# EAGLE schematic uRinks_v2.0 (EAGLE 9.2.1)

## Sheet 1 of 5
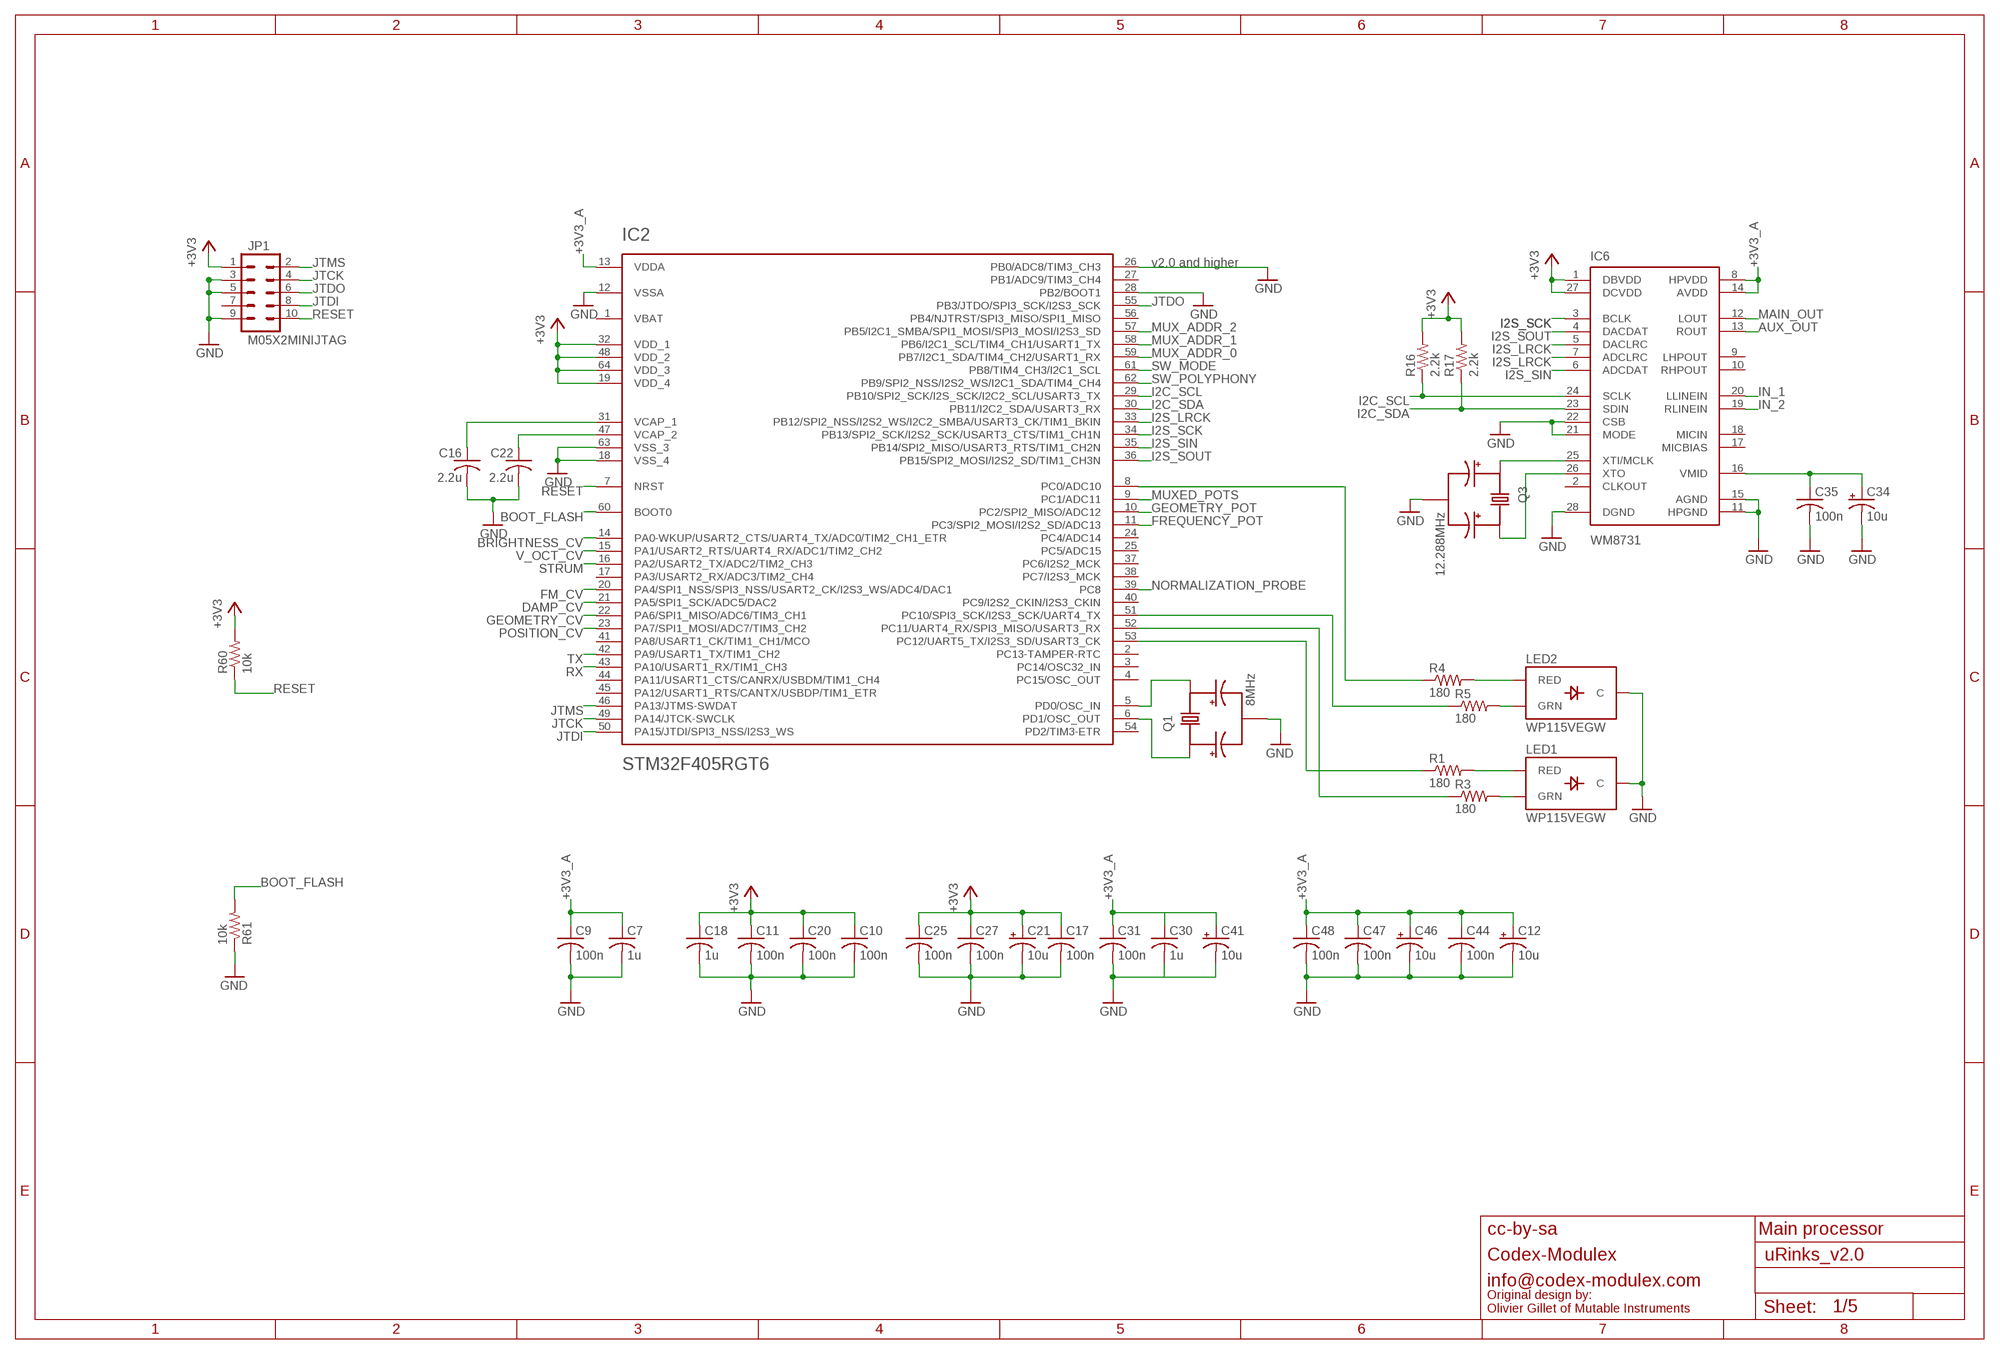
[diagram p0: schematic, sheet 1]

### Parts
C7  1u  C-USC0603  [C0603]
C9  100n  C-USC0603  [C0603]
C10  100n  C-USC0603  [C0603]
C11  100n  C-USC0603  [C0603]
C12  10u  CPOL-USA  [PANASONIC_A]
C16  2.2u  C-USC0805  [C0805]
C17  100n  C-USC0603  [C0603]
C18  1u  C-USC0603  [C0603]
C20  100n  C-USC0603  [C0603]
C21  10u  CPOL-USA  [PANASONIC_A]
C22  2.2u  C-USC0805  [C0805]
C25  100n  C-USC0603  [C0603]
C27  100n  C-USC0603  [C0603]
C30  1u  C-USC0603  [C0603]
C31  100n  C-USC0603  [C0603]
C34  10u  CPOL-USA  [PANASONIC_A]
C35  100n  C-USC0603  [C0603]
C41  10u  CPOL-USA  [PANASONIC_A]
C44  100n  C-USC0603  [C0603]
C46  10u  CPOL-USA  [PANASONIC_A]
C47  100n  C-USC0603  [C0603]
C48  100n  C-USC0603  [C0603]
IC2  STM32F405RGT6  STM32F20X  [TQFP-10X10-64]
IC6  WM8731  [SSOP28]
JP1  M05X2MINIJTAG  [2X5-1.27]
LED1  WP115VEGW  LED-BICOLOR-THROUGHHOLE  [LED-BICOLOR-THROUGHHOLE]
LED2  WP115VEGW  LED-BICOLOR-THROUGHHOLE  [LED-BICOLOR-THROUGHHOLE]
Q1  8MHz  INSTRUO_CRYSTAL_SMALLER  [INSTRUO_CRYSTAL_SMALLER]
Q3  12.288MHz  INSTRUO_CRYSTAL_SMALLER  [INSTRUO_CRYSTAL_SMALLER]
R1  180  R-US_R0603  [R0603]
R3  180  R-US_R0603  [R0603]
R4  180  R-US_R0603  [R0603]
R5  180  R-US_R0603  [R0603]
R16  2.2k  R-US_R0603  [R0603]
R17  2.2k  R-US_R0603  [R0603]
R60  10k  R-US_R0603  [R0603]
R61  10k  R-US_R0603  [R0603]

### Nets
+3V3: C10.1 C11.1 C17.1 C18.1 C20.1 C21.+ C25.1 C27.1 IC2.19(VDD_4) IC2.32(VDD_1) IC2.48(VDD_2) IC2.64(VDD_3) IC6.1(DBVDD) IC6.27(DCVDD) JP1.1 R16.2 R17.2 R60.2 ; also sheet 4,5
+3V3_A: C7.1 C9.1 C12.+ C30.1 C31.1 C41.+ C44.1 C46.+ C47.1 C48.1 IC2.13(VDDA) IC6.8(HPVDD) IC6.14(AVDD) ; also sheet 2,3,5
AUX_OUT: IC6.13(ROUT) ; also sheet 4
BOOT_FLASH: IC2.60(BOOT0) R61.2
BRIGHTNESS_CV: IC2.14(PA0-WKUP/USART2_CTS/UART4_TX/ADC0/TIM2_CH1_ETR) ; also sheet 3
DAMP_CV: IC2.21(PA5/SPI1_SCK/ADC5/DAC2) ; also sheet 3
FM_CV: IC2.20(PA4/SPI1_NSS/SPI3_NSS/USART2_CK/I2S3_WS/ADC4/DAC1) ; also sheet 3
FREQUENCY_POT: IC2.11(PC3/SPI2_MOSI/I2S2_SD/ADC13) ; also sheet 2
GEOMETRY_CV: IC2.22(PA6/SPI1_MISO/ADC6/TIM3_CH1) ; also sheet 3
GEOMETRY_POT: IC2.10(PC2/SPI2_MISO/ADC12) ; also sheet 2
GND: C7.2 C9.2 C10.2 C11.2 C12.- C16.2 C17.2 C18.2 C20.2 C21.- C22.2 C25.2 C27.2 C30.2 C31.2 C34.- C35.2 C41.- C44.2 C46.- C47.2 C48.2 IC2.12(VSSA) IC2.18(VSS_4) IC2.26(PB0/ADC8/TIM3_CH3) IC2.28(PB2/BOOT1) IC2.63(VSS_3) IC6.11(HPGND) IC6.15(AGND) IC6.21(MODE) IC6.22(CSB) IC6.28(DGND) JP1.3 JP1.5 JP1.9 LED1.2(C) LED2.2(C) Q1.GND Q3.GND R61.1 ; also sheet 2,3,4,5
I2C_SCL: IC2.29(PB10/SPI2_SCK/I2S_SCK/I2C2_SCL/USART3_TX) IC6.24(SCLK) R16.1
I2C_SDA: IC2.30(PB11/I2C2_SDA/USART3_RX) IC6.23(SDIN) R17.1
I2S_LRCK: IC2.33(PB12/SPI2_NSS/I2S2_WS/I2C2_SMBA/USART3_CK/TIM1_BKIN) IC6.5(DACLRC) IC6.7(ADCLRC)
I2S_SCK: IC2.34(PB13/SPI2_SCK/I2S2_SCK/USART3_CTS/TIM1_CH1N) IC6.3(BCLK)
I2S_SIN: IC2.35(PB14/SPI2_MISO/USART3_RTS/TIM1_CH2N) IC6.6(ADCDAT)
I2S_SOUT: IC2.36(PB15/SPI2_MOSI/I2S2_SD/TIM1_CH3N) IC6.4(DACDAT)
IN_1: IC6.20(LLINEIN) ; also sheet 4
IN_2: IC6.19(RLINEIN) ; also sheet 4
JTCK: IC2.49(PA14/JTCK-SWCLK) JP1.4
JTDI: IC2.50(PA15/JTDI/SPI3_NSS/I2S3_WS) JP1.8
JTDO: IC2.55(PB3/JTDO/SPI3_SCK/I2S3_SCK) JP1.6
JTMS: IC2.46(PA13/JTMS-SWDAT) JP1.2
MAIN_OUT: IC6.12(LOUT) ; also sheet 4
MUX_ADDR_0: IC2.59(PB7/I2C1_SDA/TIM4_CH2/USART1_RX) ; also sheet 2
MUX_ADDR_1: IC2.58(PB6/I2C1_SCL/TIM4_CH1/USART1_TX) ; also sheet 2
MUX_ADDR_2: IC2.57(PB5/I2C1_SMBA/SPI1_MOSI/SPI3_MOSI/I2S3_SD) ; also sheet 2
MUXED_POTS: IC2.9(PC1/ADC11) ; also sheet 2
N$7: IC2.6(PD1/OSC_OUT) Q1.X1
N$8: IC2.5(PD0/OSC_IN) Q1.X2
N$12: LED1.3(RED) R1.2
N$13: C22.1 IC2.47(VCAP_2)
N$17: C34.+ C35.1 IC6.16(VMID)
N$19: C16.1 IC2.31(VCAP_1)
N$22: LED1.1(GRN) R3.2
N$27: LED2.3(RED) R4.2
N$35: LED2.1(GRN) R5.2
N$37: IC2.52(PC11/UART4_RX/SPI3_MISO/USART3_RX) R3.1
N$40: IC2.8(PC0/ADC10) R4.1
N$41: IC6.25(XTI/MCLK) Q3.X1
N$42: IC6.26(XTO) Q3.X2
N$43: IC2.53(PC12/UART5_TX/I2S3_SD/USART3_CK) R1.1
N$44: IC2.51(PC10/SPI3_SCK/I2S3_SCK/UART4_TX) R5.1
NORMALIZATION_PROBE: IC2.39(PC8) ; also sheet 4
POSITION_CV: IC2.23(PA7/SPI1_MOSI/ADC7/TIM3_CH2) ; also sheet 3
RESET: IC2.7(NRST) JP1.10 R60.1
RX: IC2.43(PA10/USART1_RX/TIM1_CH3)
STRUM: IC2.16(PA2/USART2_TX/ADC2/TIM2_CH3) ; also sheet 4
SW_MODE: IC2.61(PB8/TIM4_CH3/I2C1_SCL) ; also sheet 2
SW_POLYPHONY: IC2.62(PB9/SPI2_NSS/I2S2_WS/I2C1_SDA/TIM4_CH4) ; also sheet 2
TX: IC2.42(PA9/USART1_TX/TIM1_CH2)
V_OCT_CV: IC2.15(PA1/USART2_RTS/UART4_RX/ADC1/TIM2_CH2) ; also sheet 3
Unconnected: IC2.2(PC13-TAMPER-RTC) IC2.3(PC14/OSC32_IN) IC2.4(PC15/OSC_OUT) IC2.17(PA3/USART2_RX/ADC3/TIM2_CH4) IC2.24(PC4/ADC14) IC2.25(PC5/ADC15) IC2.27(PB1/ADC9/TIM3_CH4) IC2.37(PC6/I2S2_MCK) IC2.38(PC7/I2S3_MCK) IC2.40(PC9/I2S2_CKIN/I2S3_CKIN) IC2.41(PA8/USART1_CK/TIM1_CH1/MCO) IC2.44(PA11/USART1_CTS/CANRX/USBDM/TIM1_CH4) IC2.45(PA12/USART1_RTS/CANTX/USBDP/TIM1_ETR) IC2.54(PD2/TIM3-ETR) IC2.56(PB4/NJTRST/SPI3_MISO/SPI1_MISO) IC6.2(CLKOUT) IC6.9(LHPOUT) IC6.10(RHPOUT) IC6.17(MICBIAS) IC6.18(MICIN) JP1.7

### Notes on the sheet
- v2.0 and higher
- cc-by-sa | Main processor
- Codex-Modulex
- info@codex-modulex.com
- Original design by:
  Olivier Gillet of Mutable Instruments

## Sheet 2 of 5
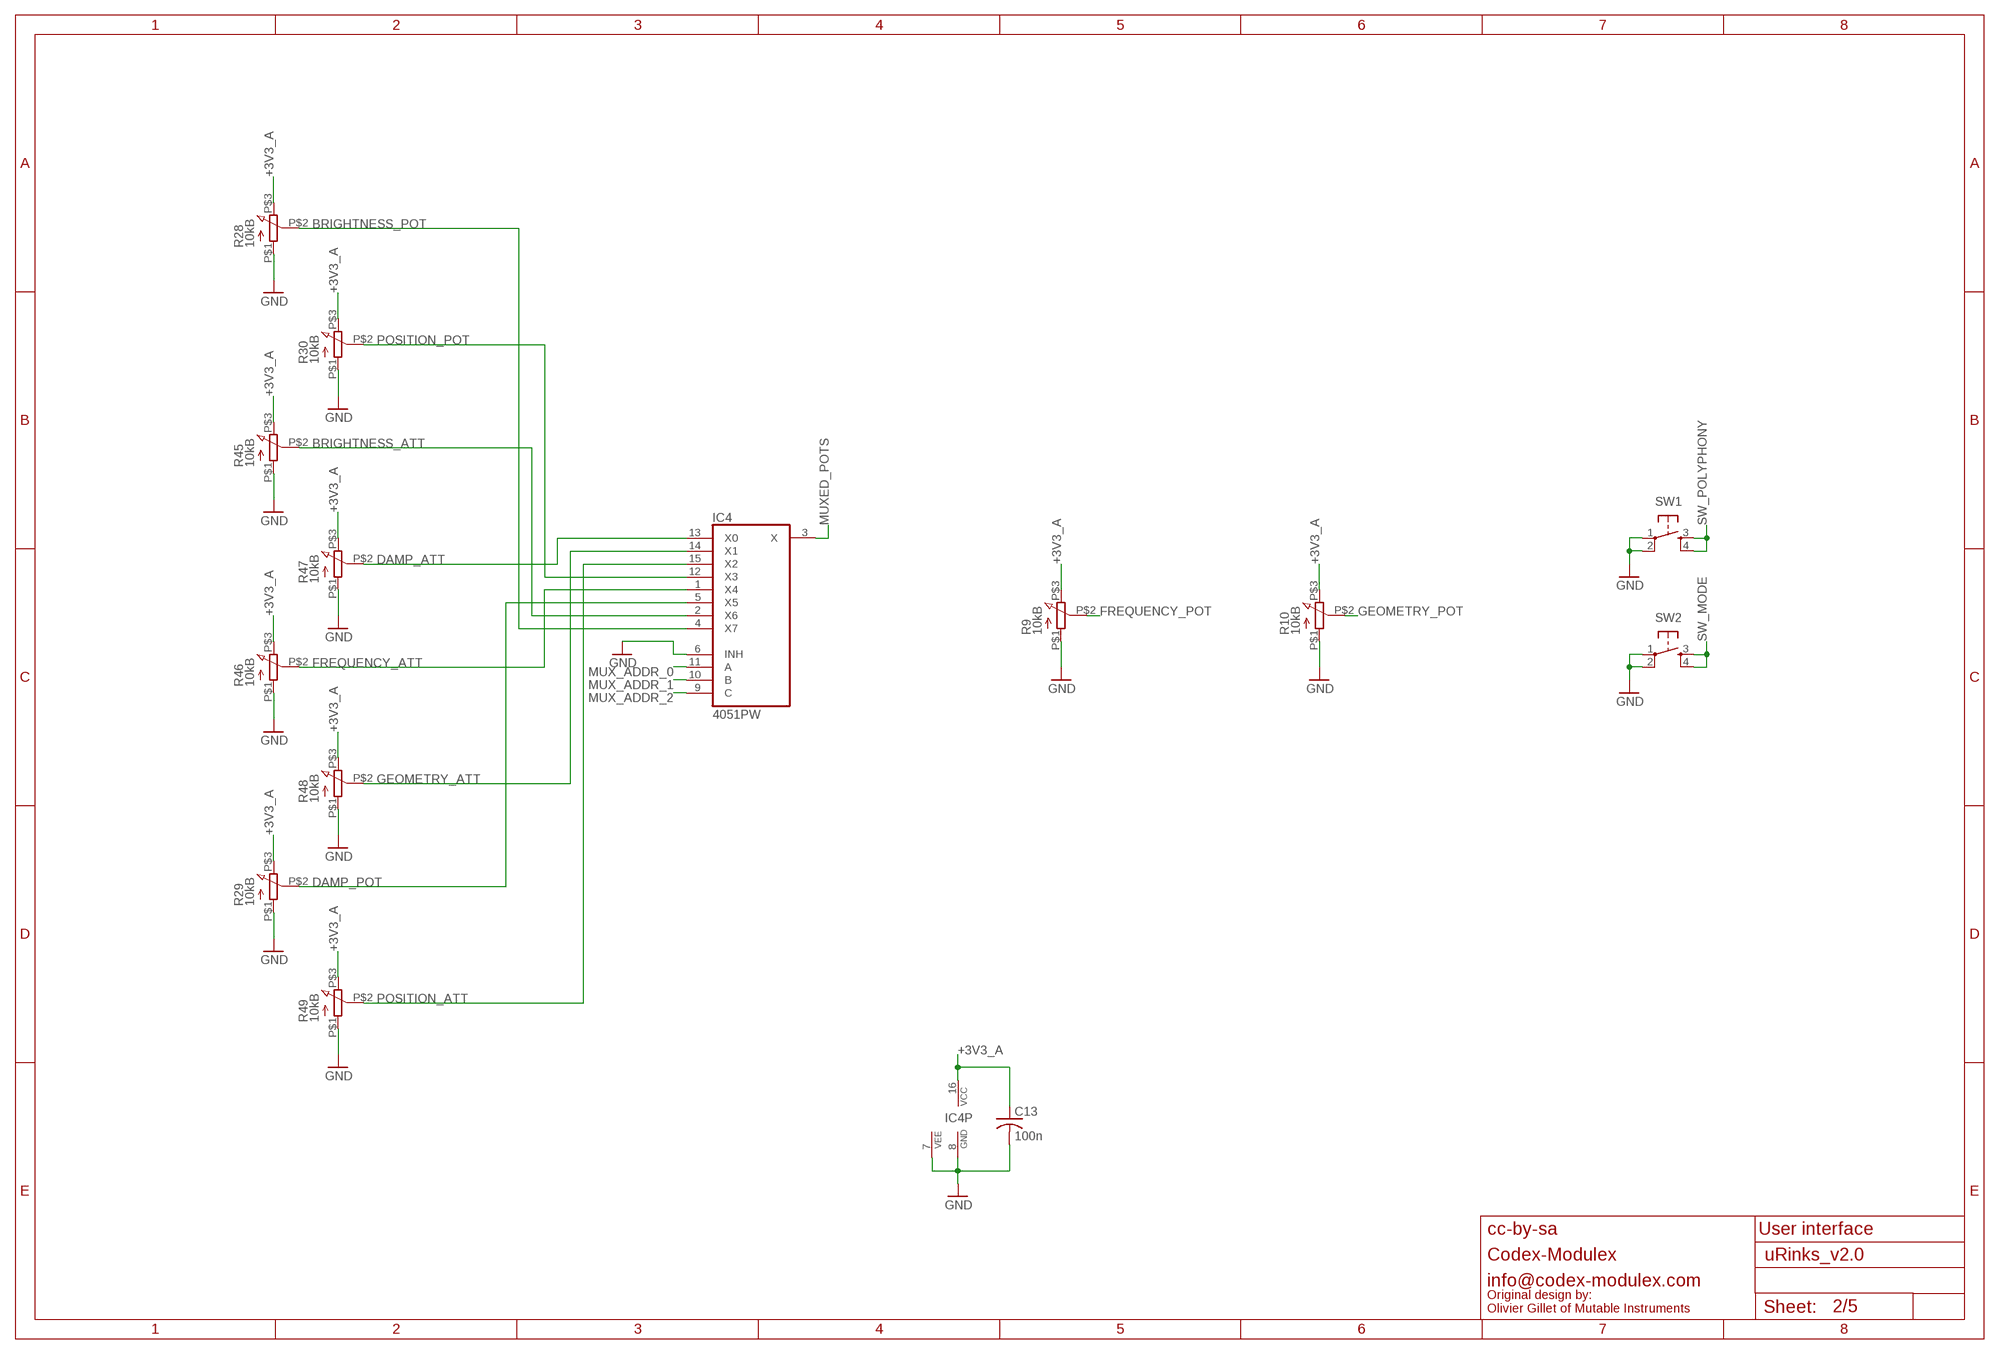
[diagram p1: schematic, sheet 2]

### Parts
C13  100n  C-USC0603  [C0603]
IC4  4051PW  [TSSOP16]
R9  10kB  INSTRUO_Q-POT2  [INSTRUO_Q-POT2]
R10  10kB  INSTRUO_Q-POT2  [INSTRUO_Q-POT2]
R28  10kB  INSTRUO_Q-POT2  [INSTRUO_Q-POT2]
R29  10kB  INSTRUO_Q-POT2  [INSTRUO_Q-POT2]
R30  10kB  INSTRUO_Q-POT2  [INSTRUO_Q-POT2]
R45  10kB  INSTRUO_Q-POT2  [INSTRUO_Q-POT2]
R46  10kB  INSTRUO_Q-POT2  [INSTRUO_Q-POT2]
R47  10kB  INSTRUO_Q-POT2  [INSTRUO_Q-POT2]
R48  10kB  INSTRUO_Q-POT2  [INSTRUO_Q-POT2]
R49  10kB  INSTRUO_Q-POT2  [INSTRUO_Q-POT2]
SW1  TAC_SWITCHPTH  [TACTILE-PTH]
SW2  TAC_SWITCHPTH  [TACTILE-PTH]

### Nets
+3V3_A: C13.1 IC4.16(VCC) R9.P$3 R10.P$3 R28.P$3 R29.P$3 R30.P$3 R45.P$3 R46.P$3 R47.P$3 R48.P$3 R49.P$3 ; also sheet 1,3,5
BRIGHTNESS_ATT: IC4.2(X6) R45.P$2
BRIGHTNESS_POT: IC4.4(X7) R28.P$2
DAMP_ATT: IC4.13(X0) R47.P$2
DAMP_POT: IC4.5(X5) R29.P$2
FREQUENCY_ATT: IC4.1(X4) R46.P$2
FREQUENCY_POT: R9.P$2 ; also sheet 1
GEOMETRY_ATT: IC4.14(X1) R48.P$2
GEOMETRY_POT: R10.P$2 ; also sheet 1
GND: C13.2 IC4.6(INH) IC4.7(VEE) IC4.8(GND) R9.P$1 R10.P$1 R28.P$1 R29.P$1 R30.P$1 R45.P$1 R46.P$1 R47.P$1 R48.P$1 R49.P$1 SW1.1 SW1.2 SW2.1 SW2.2 ; also sheet 1,3,4,5
MUX_ADDR_0: IC4.11(A) ; also sheet 1
MUX_ADDR_1: IC4.10(B) ; also sheet 1
MUX_ADDR_2: IC4.9(C) ; also sheet 1
MUXED_POTS: IC4.3(X) ; also sheet 1
POSITION_ATT: IC4.15(X2) R49.P$2
POSITION_POT: IC4.12(X3) R30.P$2
SW_MODE: SW2.3 SW2.4 ; also sheet 1
SW_POLYPHONY: SW1.3 SW1.4 ; also sheet 1

### Notes on the sheet
- cc-by-sa | User interface
- Codex-Modulex
- info@codex-modulex.com
- Original design by:
  Olivier Gillet of Mutable Instruments

## Sheet 3 of 5
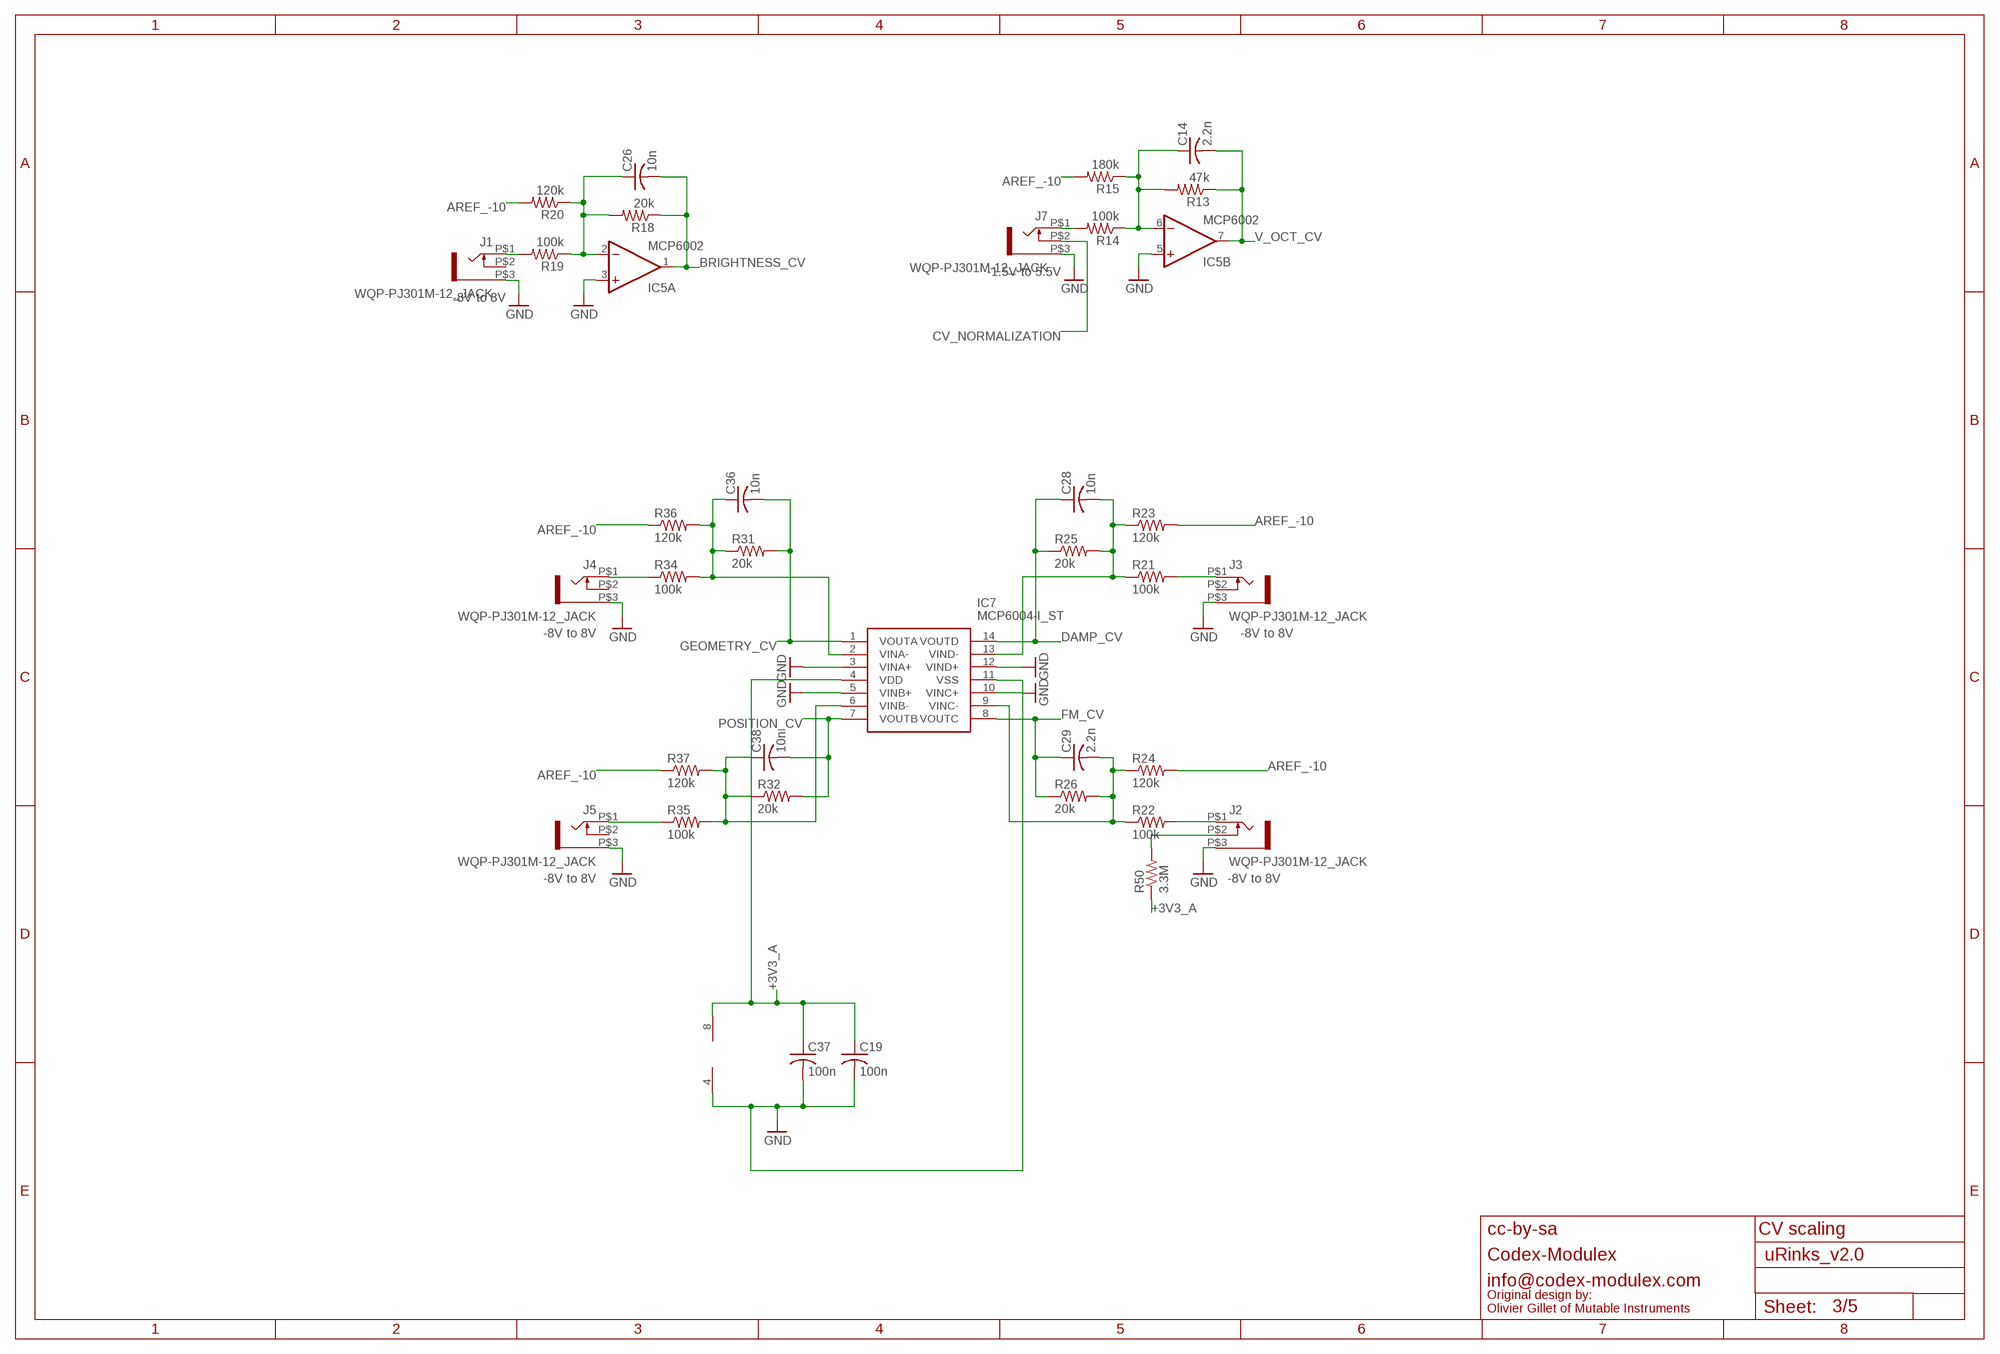
[diagram p2: schematic, sheet 3]

### Parts
C14  2.2n  C-USC0603  [C0603]
C19  100n  C-USC0603  [C0603]
C26  10n  C-USC0603  [C0603]
C28  10n  C-USC0603  [C0603]
C29  2.2n  C-USC0603  [C0603]
C36  10n  C-USC0603  [C0603]
C37  100n  C-USC0603  [C0603]
C38  10n  C-USC0603  [C0603]
IC5  MCP6002  TL072D  [SO08]
IC7  MCP6004-I_ST  [SOP65P640X120-14N]
J1  WQP-PJ301M-12_JACK  [WQP-PJ301M-12_JACK]
J2  WQP-PJ301M-12_JACK  [WQP-PJ301M-12_JACK]
J3  WQP-PJ301M-12_JACK  [WQP-PJ301M-12_JACK]
J4  WQP-PJ301M-12_JACK  [WQP-PJ301M-12_JACK]
J5  WQP-PJ301M-12_JACK  [WQP-PJ301M-12_JACK]
J7  WQP-PJ301M-12_JACK  [WQP-PJ301M-12_JACK]
R13  47k  R-US_R0603  [R0603]
R14  100k  R-US_R0603  [R0603]
R15  180k  R-US_R0603  [R0603]
R18  20k  R-US_R0603  [R0603]
R19  100k  R-US_R0603  [R0603]
R20  120k  R-US_R0603  [R0603]
R21  100k  R-US_R0603  [R0603]
R22  100k  R-US_R0603  [R0603]
R23  120k  R-US_R0603  [R0603]
R24  120k  R-US_R0603  [R0603]
R25  20k  R-US_R0603  [R0603]
R26  20k  R-US_R0603  [R0603]
R31  20k  R-US_R0603  [R0603]
R32  20k  R-US_R0603  [R0603]
R34  100k  R-US_R0603  [R0603]
R35  100k  R-US_R0603  [R0603]
R36  120k  R-US_R0603  [R0603]
R37  120k  R-US_R0603  [R0603]
R50  3.3M  R-US_R0603  [R0603]

### Nets
+3V3_A: C19.1 C37.1 IC5.8(P:V+) IC7.4(VDD) R50.1 ; also sheet 1,2,5
AREF_-10: R15.2 R20.2 R23.2 R24.2 R36.1 R37.1 ; also sheet 5
BRIGHTNESS_CV: C26.2 IC5.1(A:OUT) R18.1 ; also sheet 1
CV_NORMALIZATION: J7.P$2 ; also sheet 4
DAMP_CV: C28.1 IC7.14(VOUTD) R25.1 ; also sheet 1
FM_CV: C29.1 IC7.8(VOUTC) R26.1 ; also sheet 1
GEOMETRY_CV: C36.2 IC7.1(VOUTA) R31.2 ; also sheet 1
GND: C19.2 C37.2 IC5.3(A:+IN) IC5.4(P:V-) IC5.5(B:+IN) IC7.3(VINA+) IC7.5(VINB+) IC7.10(VINC+) IC7.11(VSS) IC7.12(VIND+) J1.P$3 J2.P$3 J3.P$3 J4.P$3 J5.P$3 J7.P$3 ; also sheet 1,2,4,5
N$1: J1.P$1 R19.2
N$2: C26.1 IC5.2(A:-IN) R18.2 R19.1 R20.1
N$3: J7.P$1 R14.2
N$6: J3.P$1 R21.2
N$10: J2.P$1 R22.2
N$11: C29.2 IC7.9(VINC-) R22.1 R24.1 R26.2
N$14: C14.1 IC5.6(B:-IN) R13.2 R14.1 R15.1
N$15: C28.2 IC7.13(VIND-) R21.1 R23.1 R25.2
N$26: J4.P$1 R34.1
N$30: C36.1 IC7.2(VINA-) R31.1 R34.2 R36.2
N$48: J5.P$1 R35.1
N$49: C38.1 IC7.6(VINB-) R32.1 R35.2 R37.2
N$53: J2.P$2 R50.2
POSITION_CV: C38.2 IC7.7(VOUTB) R32.2 ; also sheet 1
V_OCT_CV: C14.2 IC5.7(B:OUT) R13.1 ; also sheet 1
Unconnected: J1.P$2 J3.P$2 J4.P$2 J5.P$2

### Notes on the sheet
- -1.5V to 5.5V
- -8V to 8V
- -8V to 8V | -8V to 8V
- -8V to 8V | -8V to 8V
- cc-by-sa | CV scaling
- Codex-Modulex
- info@codex-modulex.com
- Original design by:
  Olivier Gillet of Mutable Instruments

## Sheet 4 of 5
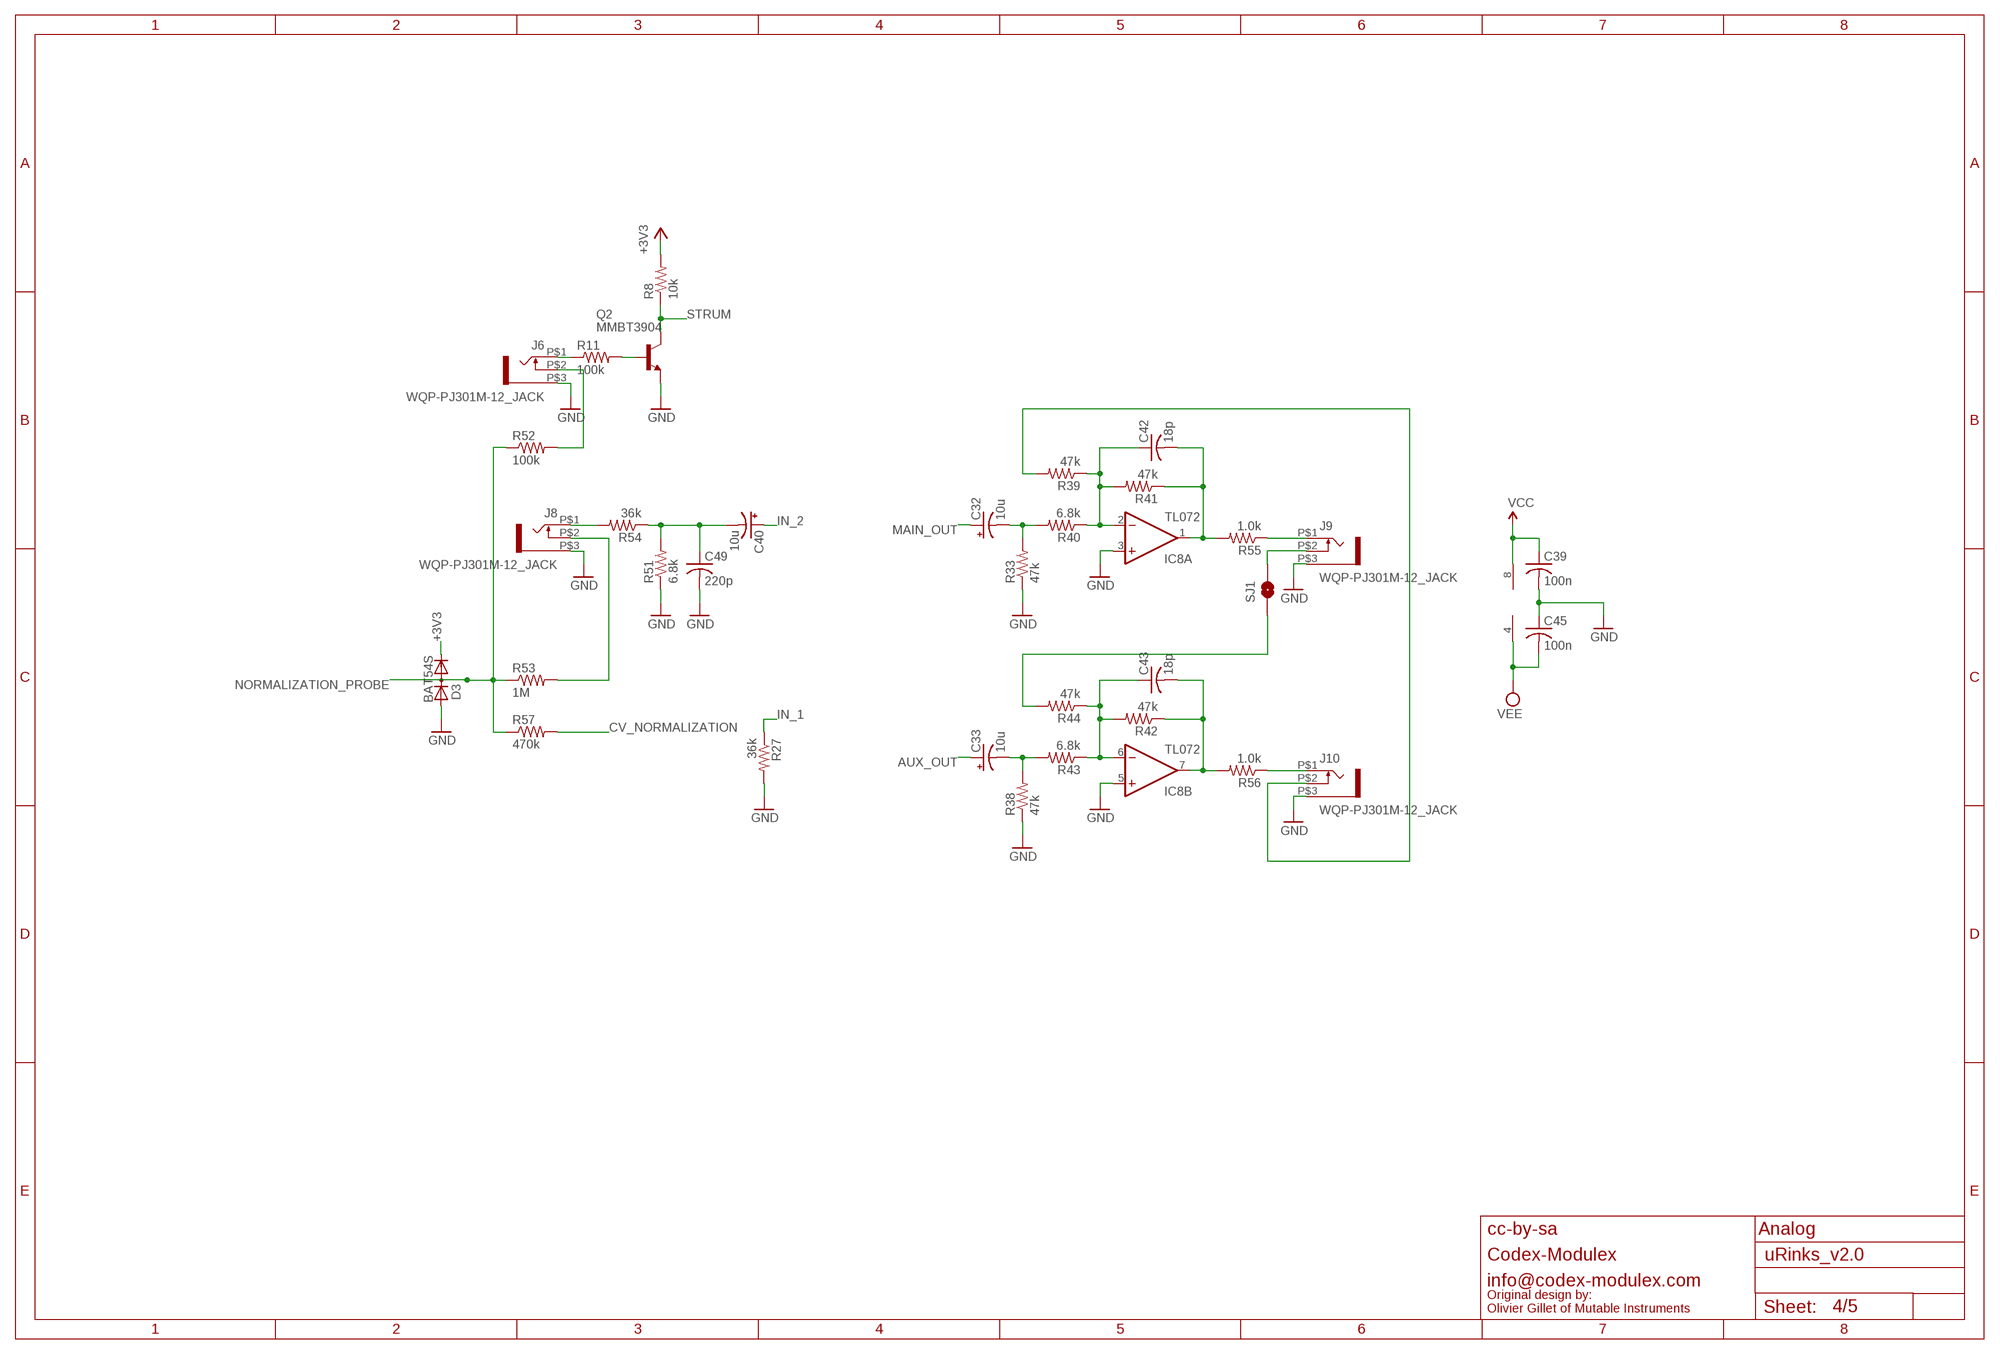
[diagram p3: schematic, sheet 4]

### Parts
C32  10u  CPOL-USA  [PANASONIC_A]
C33  10u  CPOL-USA  [PANASONIC_A]
C39  100n  C-USC0603  [C0603]
C40  10u  CPOL-USA  [PANASONIC_A]
C42  18p  C-USC0603  [C0603]
C43  18p  C-USC0603  [C0603]
C45  100n  C-USC0603  [C0603]
C49  220p  C-USC0603  [C0603]
D3  BAT54S  DIODE_2CACA-SOT23  [SOT23]
IC8  TL072  TL072D  [SO08]
J6  WQP-PJ301M-12_JACK  [WQP-PJ301M-12_JACK]
J8  WQP-PJ301M-12_JACK  [WQP-PJ301M-12_JACK]
J9  WQP-PJ301M-12_JACK  [WQP-PJ301M-12_JACK]
J10  WQP-PJ301M-12_JACK  [WQP-PJ301M-12_JACK]
Q2  MMBT3904  MMBT3904LT1-NPN-SOT23-BEC  [SOT23-BEC]
R8  10k  R-US_R0603  [R0603]
R11  100k  R-US_R0603  [R0603]
R27  36k  R-US_R0603  [R0603]
R33  47k  R-US_R0603  [R0603]
R38  47k  R-US_R0603  [R0603]
R39  47k  R-US_R0603  [R0603]
R40  6.8k  R-US_R0603  [R0603]
R41  47k  R-US_R0603  [R0603]
R42  47k  R-US_R0603  [R0603]
R43  6.8k  R-US_R0603  [R0603]
R44  47k  R-US_R0603  [R0603]
R51  6.8k  R-US_R0603  [R0603]
R52  100k  R-US_R0603  [R0603]
R53  1M  R-US_R0603  [R0603]
R54  36k  R-US_R0603  [R0603]
R55  1.0k  R-US_R0603  [R0603]
R56  1.0k  R-US_R0603  [R0603]
R57  470k  R-US_R0603  [R0603]
SJ1  SOLDERJUMPERNC2  [SJ_2S-NOTRACE]

### Nets
+3V3: D3.2(C) R8.2 ; also sheet 1,5
AUX_OUT: C33.+ ; also sheet 1
CV_NORMALIZATION: R57.2 ; also sheet 3
GND: C39.2 C45.1 C49.2 D3.1(A) IC8.3(A:+IN) IC8.5(B:+IN) J6.P$3 J8.P$3 J9.P$3 J10.P$3 Q2.E R27.2 R33.1 R38.1 R51.1 ; also sheet 1,2,3,5
IN_1: R27.1 ; also sheet 1
IN_2: C40.+ ; also sheet 1
MAIN_OUT: C32.+ ; also sheet 1
N$9: J6.P$1 R11.1
N$18: C40.- C49.1 R51.2 R54.1
N$20: J6.P$2 R52.2
N$21: J8.P$1 R54.2
N$23: C33.- R38.2 R43.2
N$25: C43.1 IC8.6(B:-IN) R42.2 R43.1 R44.1
N$28: C43.2 IC8.7(B:OUT) R42.1 R56.2
N$29: J10.P$1 R56.1
N$31: C32.- R33.2 R40.2
N$32: C42.1 IC8.2(A:-IN) R39.1 R40.1 R41.2
N$33: C42.2 IC8.1(A:OUT) R41.1 R55.2
N$34: J9.P$1 R55.1
N$39: J8.P$2 R53.2
N$45: J10.P$2 R39.2
N$46: R44.2 SJ1.1
N$47: J9.P$2 SJ1.2
N$66: Q2.B R11.2
NORMALIZATION_PROBE: D3.3(AC) R52.1 R53.1 R57.1 ; also sheet 1
STRUM: Q2.C R8.1 ; also sheet 1
VCC: C39.1 IC8.8(P:V+) ; also sheet 5
VEE: C45.2 IC8.4(P:V-) ; also sheet 5

### Notes on the sheet
- cc-by-sa | Analog
- Codex-Modulex
- info@codex-modulex.com
- Original design by:
  Olivier Gillet of Mutable Instruments

## Sheet 5 of 5
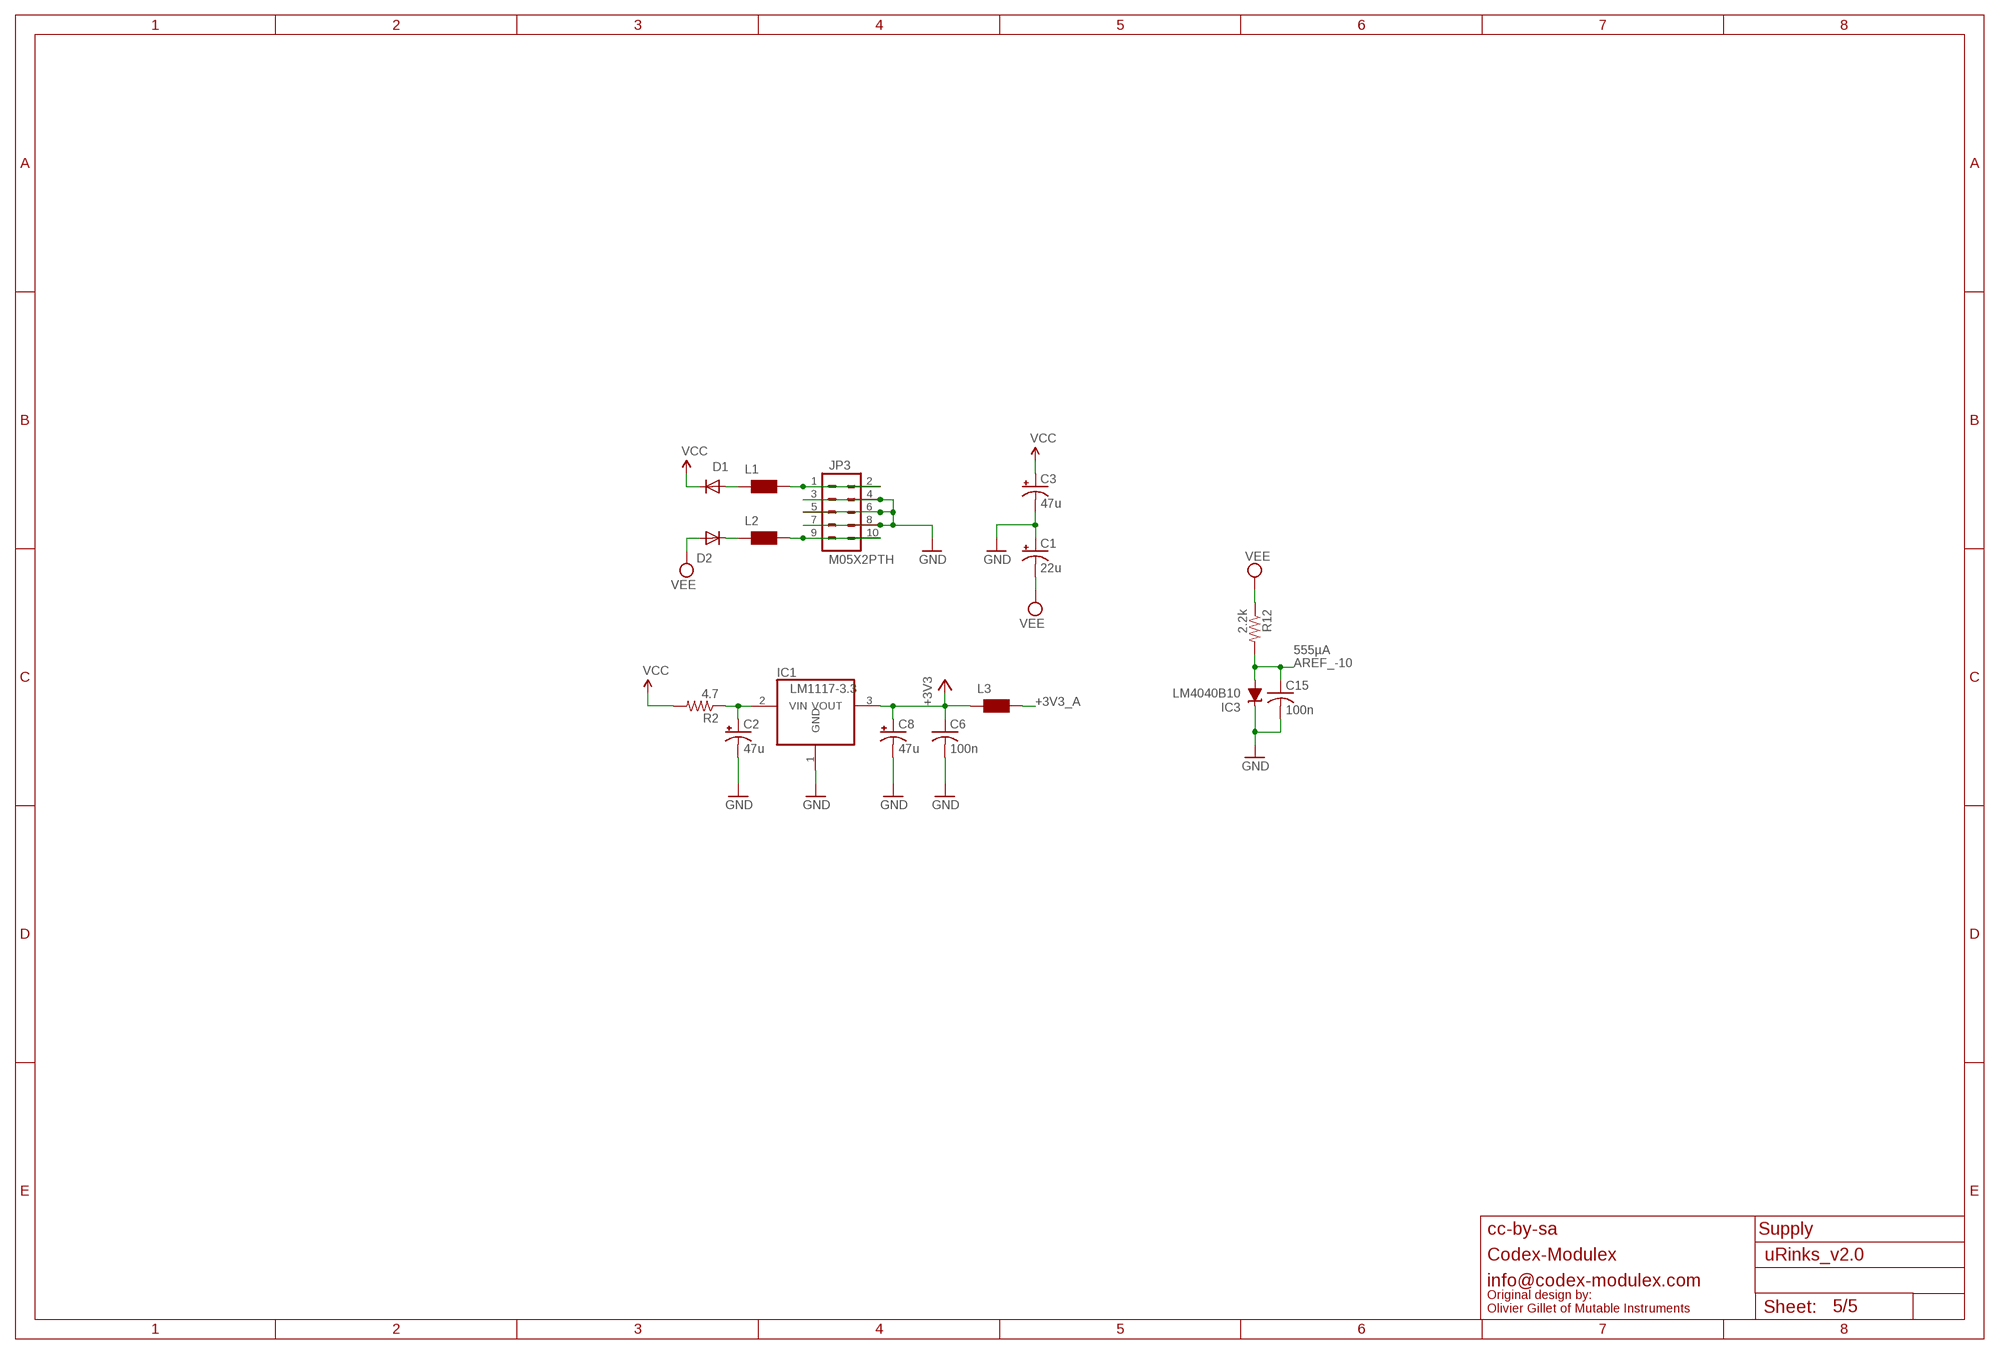
[diagram p4: schematic, sheet 5]

### Parts
C1  22u  CPOL-USC  [PANASONIC_C]
C2  47u  CPOL-USD  [PANASONIC_D]
C3  47u  CPOL-USD  [PANASONIC_D]
C6  100n  C-USC0603  [C0603]
C8  47u  CPOL-USD  [PANASONIC_D]
C15  100n  C-USC0603  [C0603]
D1  1N5819HW  DIODE-SOD123  [SOD123]
D2  1N5819HW  DIODE-SOD123  [SOD123]
IC1  LM1117-3.3  REG1117T  [TO252]
IC3  LM4040B10  LM4041B12DBZ  [DBZ_R-PDSO-G3]
JP3  M05X2PTH  [AVR_ICSP]
L1  WE-CBF_0603  [0603]
L2  WE-CBF_0603  [0603]
L3  WE-CBF_0603  [0603]
R2  4.7  R-US_R1206  [R1206]
R12  2.2k  R-US_R0603  [R0603]

### Nets
+3V3: C6.1 C8.+ IC1.3(VOUT) L3.1 ; also sheet 1,4
+3V3_A: L3.2 ; also sheet 1,2,3
AREF_-10: C15.1 IC3.2(A) R12.2 ; also sheet 3
GND: C1.+ C2.- C3.- C6.2 C8.- C15.2 IC1.1(GND) IC3.1(C) JP3.3 JP3.4 JP3.5 JP3.6 JP3.7 JP3.8 ; also sheet 1,2,3,4
N$16: C2.+ IC1.2(VIN) R2.1
N$24: D1.A L1.1
N$36: D2.C L2.1
N$56: JP3.1 JP3.2 L1.2
N$64: JP3.9 JP3.10 L2.2
VCC: C3.+ D1.C R2.2 ; also sheet 4
VEE: C1.- D2.A R12.1 ; also sheet 4

### Notes on the sheet
- 555µA
- cc-by-sa | Supply
- Codex-Modulex
- info@codex-modulex.com
- Original design by:
  Olivier Gillet of Mutable Instruments

## Power pins joined to a net without a drawn wire
VBAT: IC2.1(VBAT)

## Library data of the parts
C1-C3 C8 C12 C21 C32-C34 C40 C41 C46 = rcl:CPOL-US: POLARIZED CAPACITOR, American symbol
C6 C7 C9-C11 C13-C20 C22 C25-C27 C30 C31 C35 C37 C39 C42-C45 C47-C49 = rcl:C-US: CAPACITOR, American symbol
C28 C29 C36 C38 = resistor:C-US: CAPACITOR, American symbol
D1 D2 = diode:DIODE-: DIODE
D3 = diode:DIODE_2CACA-: 2 Diodes - Cathode-Anode|Cathode-Anode
IC1 = og-vreg:REG1117: 800mA and 1A Low Dropout (LDO) Positive Regulator 1.8V, 2.5V, 2.85V, 3.3V, 5V, and Adj
IC2 = og-stm32f2:STM32F20X
IC3 = texas:LM4041: PRECISION MICROPOWER SHUNT VOLTAGE REFERENCE Source: http://focus.ti.com/lit/ds/slcs146e/slcs146e.pdf
IC4 = og-ics:4051: 8-channel ANALOG MULTIPLEXER
IC5 = gm-ics:TL072: OP AMP
IC6 = og-dac:WM8731
IC7 = SamacSys_Parts:MCP6004-I_ST: Quad 1.8V 1MHz OpAmp,MCP6004-I/ST Source: Datasheet <https://componentsearchengine.com/Datasheets/1/MCP6004-I_ST.pdf>; DESCRIPTION: Quad 1.8V 1MHz OpAmp,MCP6004-I/ST; HEIGHT: 1.2mm; MANUFACTURER_NAME: Microchip; MANUFACTURER_PART_NUMBER: MCP6004-I/ST; MOUSER_PART_NUMBER: 579-MCP6004-I/ST
IC8 = og-linear:TL072: OP AMP
J1-J10 = thonkiconn:WQP-PJ301M-12_JACK
JP1 JP3 = og-header:M05X2: Header 5x2 Standard 10-pin dual row 0.1" header. Commonly used with AVR-ISP. Use with Spark Fun Electronics SKU: PRT-00778
L1-L3 = wuerth-elektronik:WE-CBF: SMD EMI Suppression Ferrite Beads - excellent anti-EMI properties - low DCR - impedances till 3000 ohms - rated current up to 6 A
LED1 LED2 = og-leds:LED-BICOLOR-THROUGHHOLE
Q1 Q3 = uClouds_002_:INSTRUO_CRYSTAL_SMALLER: CSTCE16M0V53-R0
Q2 = transistor:*-NPN-: NPN Transistror BF959 corrected 2008.03.06
R1-R5 R8 R11-R20 R27 R33 R38-R44 R51-R57 R60 R61 = rcl:R-US_: RESISTOR, American symbol
R9 R10 R28-R30 R45-R49 = uClouds_002_:INSTRUO_Q-POT2
R21-R26 R31 R32 R34-R37 R50 = resistor:R-US_: RESISTOR, American symbol
SJ1 = SparkFun:SOLDERJUMPER: Solder Jumper Standard SMD solder jumper. Used to automate production. Two varients : Normally Open and Normally Closed are the same, but have different paste layers. NC will have a large amount of paste and should jumper during reflow.
SW1 SW2 = SparkFun:TAC_SWITCH: Momentary Switch Button commonly used for reset or general input. Spark Fun Electronics SKU : COM-00097